# EAGLE design mate_a (EAGLE 9.6.2)
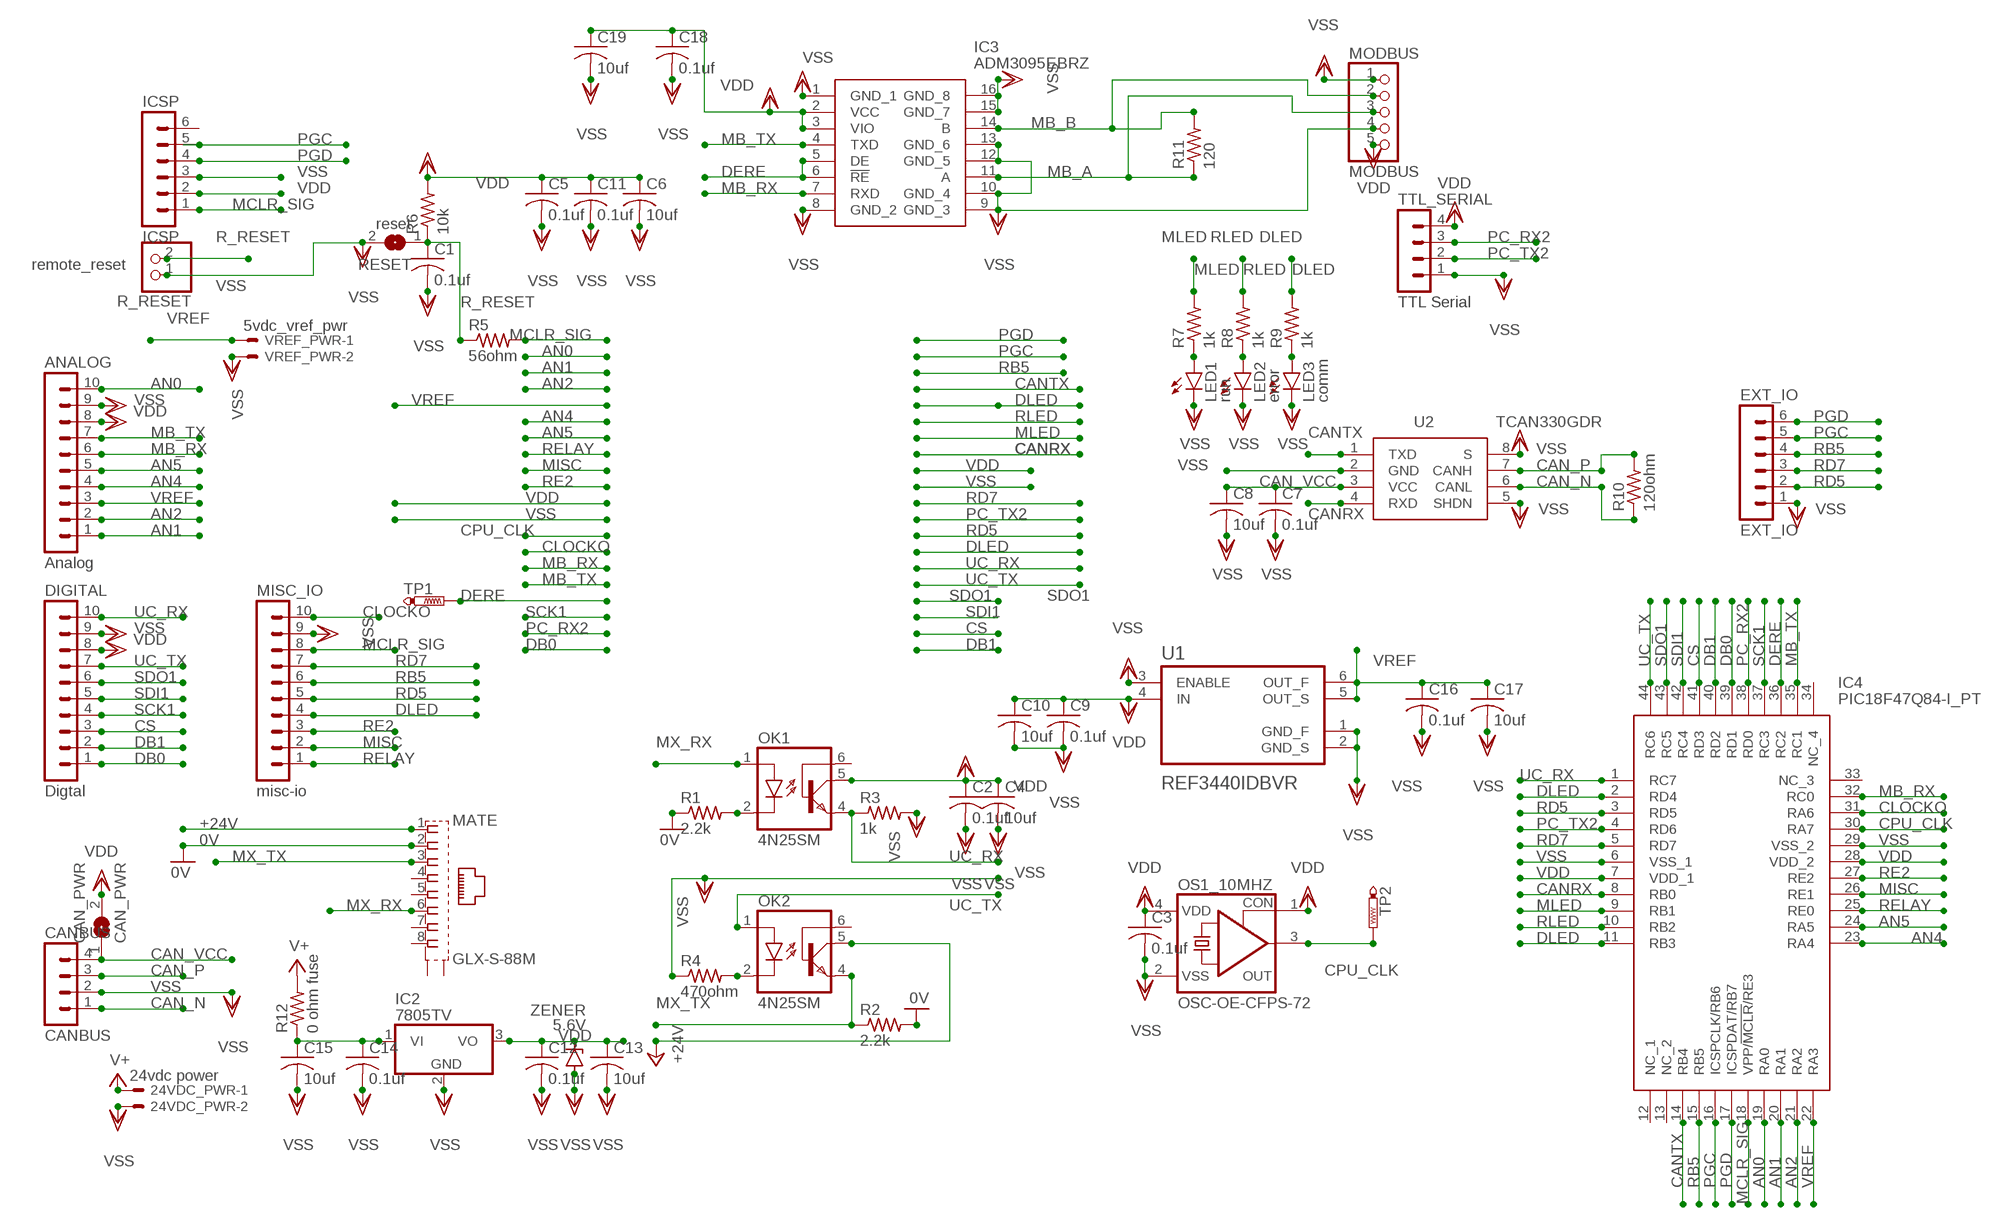
[diagram p0: schematic, sheet 1]

## Parts
24VDC_PWR  24vdc power  22-23-2021  [22-23-2021]
ANALOG  Analog  MA10-1  [MA10-1]
C1  0.1uf  C-USC0805  [C0805]
C2  0.1uf  C-USC0805  [C0805]
C3  0.1uf  C-USC0805  [C0805]
C4  10uf  C-USC0805  [C0805]
C5  0.1uf  C-USC0805  [C0805]
C6  10uf  C-USC0805  [C0805]
C7  0.1uf  C-USC0805  [C0805]
C8  10uf  C-USC0805  [C0805]
C9  0.1uf  C-USC0805  [C0805]
C10  10uf  C-USC0805  [C0805]
C11  0.1uf  C-USC0805  [C0805]
C12  0.1uf  C-USC0805  [C0805]
C13  10uf  C-USC0805  [C0805]
C14  0.1uf  C-USC0805  [C0805]
C15  10uf  C-USC0805  [C0805]
C16  0.1uf  C-USC0805  [C0805]
C17  10uf  C-USC0805  [C0805]
C18  0.1uf  C-USC0805  [C0805]
C19  10uf  C-USC0805  [C0805]
CAN_PWR  CAN_PWR  SJ  [SJ]
CANBUS  CANBUS  MA04-1  [MA04-1]
DIGITAL  Digtal  MA10-1  [MA10-1]
EXT_IO  EXT_IO  MA06-1  [MA06-1]
IC2  7805TV  [TO220V]
IC3  ADM3095EBRZ  [SOIC127P600X175-16N]
IC4  PIC18F47Q84-I_PT  [QFP80P1200X1200X120-44N]
ICSP  ICSP  MA06-1  [MA06-1]
LED1  run  LEDCHIPLED_0805  [CHIPLED_0805]
LED2  error  LEDCHIPLED_0805  [CHIPLED_0805]
LED3  comm  LEDCHIPLED_0805  [CHIPLED_0805]
MATE  GLX-S-88M  [GLX-S-88M]
MISC_IO  misc-io  MA10-1  [MA10-1]
MODBUS  MODBUS  PINHD-1X5  [1X05]
OK1  4N25SM  [DIL6-SMD]
OK2  4N25SM  [DIL6-SMD]
OS1_10MHZ  OSC-OE-CFPS-72  [7.2X5.2-4-PAD]
R1  2.2k  R-US_R0805  [R0805]
R2  2.2k  R-US_R0805  [R0805]
R3  1k  R-US_R0805  [R0805]
R4  470ohm  R-US_R0805  [R0805]
R5  56ohm  R-US_R0805  [R0805]
R6  10k  R-US_R0805  [R0805]
R7  1k  R-US_R0805  [R0805]
R8  1k  R-US_R0805  [R0805]
R9  1k  R-US_R0805  [R0805]
R10  120ohm  R-US_R0805  [R0805]
R11  120  R-US_R0805  [R0805]
R12  0 ohm fuse  R-US_R1206  [R1206]
R_RESET  remote_reset  PINHD-1X2  [1X02]
RESET  reset  SJ  [SJ]
TP1  PTR1PAD1-13  [P1-13]
TP2  PTR1PAD1-13  [P1-13]
TTL_SERIAL  TTL Serial  MA04-1  [MA04-1]
U1  REF3440IDBVR  [SOT95P280X145-6N]
U2  TCAN330GDR  [SOIC127P600X175-8N]
VREF_PWR  5vdc_vref_pwr  22-23-2021  [22-23-2021]
ZENER  5.6V  ZENER-DIODESMB  [SMB]

## Nets
0V [icurrent]: MATE.2 R1.1 R2.2
+24V [icurrent]: MATE.1 OK2.5(COL)
AN0: ANALOG.10 IC4.19(RA0)
AN1: ANALOG.1 IC4.20(RA1)
AN2: ANALOG.2 IC4.21(RA2)
AN4: ANALOG.4 IC4.23(RA4)
AN5: ANALOG.5 IC4.24(RA5)
CAN_N [icurrent]: CANBUS.1 R10.1 U2.6(CANL)
CAN_P [icurrent]: CANBUS.3 R10.2 U2.7(CANH)
CAN_VCC [icurrent]: C7.1 C8.1 CAN_PWR.1 CANBUS.4 U2.3(VCC)
CANRX: IC4.8(RB0) U2.4(RXD)
CANTX: IC4.14(RB4) U2.1(TXD)
CLOCKO: IC4.31(RA6) MISC_IO.10
CPU_CLK: IC4.30(RA7) OS1_10MHZ.3(OUT) TP2.TP
CS: DIGITAL.3 IC4.41(RD3)
DB0: DIGITAL.1 IC4.39(RD1)
DB1: DIGITAL.2 IC4.40(RD2)
DERE: IC3.5(DE) IC3.6(!RE) IC4.36(RC2) TP1.TP
DLED: IC4.2(RD4) IC4.11(RB3) MISC_IO.4 R9.2
MB_A: IC3.11(A) MODBUS.3 R11.1
MB_B: IC3.14(B) MODBUS.2 R11.2
MB_RX: ANALOG.6 IC3.7(RXD) IC4.32(RC0)
MB_TX: ANALOG.7 IC3.4(TXD) IC4.35(RC1)
MCLR_SIG: IC4.18(VPP/!MCLR!/RE3) ICSP.1 MISC_IO.8 R5.2
MISC: IC4.26(RE1) MISC_IO.2
MLED: IC4.9(RB1) R7.2
MX_RX: MATE.6 OK1.1(A)
MX_TX: MATE.3 OK2.4(EMI) R2.1
N$1: OK1.2(C) R1.2
N$2 [icurrent]: C14.1 C15.1 IC2.1(VI) R12.1
N$3: OK2.2(C) R4.2
N$4: LED1.A R7.1
N$5: LED2.A R8.1
N$6: LED3.A R9.1
PC_RX2: IC4.38(RD0) TTL_SERIAL.3
PC_TX2: IC4.4(RD6) TTL_SERIAL.2
PGC: EXT_IO.5 IC4.16(ICSPCLK/RB6) ICSP.5
PGD: EXT_IO.6 IC4.17(ICSPDAT/RB7) ICSP.4
R_RESET: C1.1 R5.1 R6.1 R_RESET.2 RESET.1
RB5: EXT_IO.4 IC4.15(RB5) MISC_IO.6
RD5: EXT_IO.2 IC4.3(RD5) MISC_IO.5
RD7: EXT_IO.3 IC4.5(RD7) MISC_IO.7
RE2: IC4.27(RE2) MISC_IO.3
RELAY: IC4.25(RE0) MISC_IO.1
RLED: IC4.10(RB2) R8.2
SCK1: DIGITAL.4 IC4.37(RC3)
SDI1: DIGITAL.5 IC4.42(RC4)
SDO1: DIGITAL.6 IC4.43(RC5)
UC_RX: DIGITAL.10 IC4.1(RC7) OK1.4(EMI) R3.1
UC_TX: DIGITAL.7 IC4.44(RC6) OK2.1(A)
V+ [icurrent]: 24VDC_PWR.1 R12.2
VDD [icurrent]: ANALOG.8 C2.1 C3.1 C4.1 C5.1 C6.1 C9.1 C10.1 C11.1 C12.1 C13.1 C18.1 C19.1 CAN_PWR.2 DIGITAL.8 IC2.3(VO) IC3.2(VCC) IC3.3(VIO) IC4.7(VDD_1) IC4.28(VDD_2) ICSP.2 MODBUS.5 OK1.5(COL) OS1_10MHZ.1(CON) OS1_10MHZ.4(VDD) R6.2 TTL_SERIAL.4 U1.4(IN) ZENER.C
VREF [icurrent]: ANALOG.3 C16.1 C17.1 IC4.22(RA3) U1.5(OUT_S) U1.6(OUT_F) VREF_PWR.1
VSS [icurrent]: 24VDC_PWR.2 ANALOG.9 C1.2 C2.2 C3.2 C4.2 C5.2 C6.2 C7.2 C8.2 C9.2 C10.2 C11.2 C12.2 C13.2 C14.2 C15.2 C16.2 C17.2 C18.2 C19.2 CANBUS.2 DIGITAL.9 EXT_IO.1 IC2.2(GND) IC3.1(GND_1) IC3.8(GND_2) IC3.9(GND_3) IC3.10(GND_4) IC3.12(GND_5) IC3.13(GND_6) IC3.15(GND_7) IC3.16(GND_8) IC4.6(VSS_1) IC4.29(VSS_2) ICSP.3 LED1.C LED2.C LED3.C MISC_IO.9 MODBUS.1 MODBUS.4 OS1_10MHZ.2(VSS) R3.2 R4.1 R_RESET.1 RESET.2 TTL_SERIAL.1 U1.1(GND_F) U1.2(GND_S) U1.3(ENABLE) U2.2(GND) U2.5(SHDN) U2.8(S) VREF_PWR.2 ZENER.A
Unconnected: IC4.12(NC_1) IC4.13(NC_2) IC4.33(NC_3) IC4.34(NC_4) ICSP.6 MATE.4 MATE.5 MATE.7 MATE.8 MATE.S1 MATE.S2 OK1.6(BAS) OK2.6(BAS)

## Library data of the parts
24VDC_PWR VREF_PWR = con-molex:22-23-2021: .100" (2.54mm) Center Header - 2 Pin; MF: MOLEX; MPN: 22-23-2021; OC_FARNELL: 1462926; OC_NEWARK: 25C3832
ANALOG DIGITAL MISC_IO = con-lstb:MA10-1: PIN HEADER; OC_FARNELL: unknown; OC_NEWARK: unknown
C1-C19 = rcl:C-US: CAPACITOR, American symbol; SPICEPREFIX: C
CAN_PWR RESET = jumper:SJ: SMD solder JUMPER
CANBUS TTL_SERIAL = con-lstb:MA04-1: PIN HEADER; OC_FARNELL: unknown; OC_NEWARK: unknown
EXT_IO ICSP = con-lstb:MA06-1: PIN HEADER; OC_FARNELL: unknown; OC_NEWARK: unknown
IC2 = linear:78*: Positive VOLTAGE REGULATOR Source: http://cache.national.com/ds/LM/LM78L05.pdf http://www.fairchildsemi.com/ds/LM/LM7805.pdf
IC3 = ADM3095EBRZ:ADM3095EBRZ: Level 4 EMC Protected RS-485 Transceiver with Full +/-42 V Fault Protection Source: Datasheet <https://componentsearchengine.com/Datasheets/1/ADM3095EBRZ.pdf>; DESCRIPTION: Level 4 EMC Protected RS-485 Transceiver with Full +/-42 V Fault Protection; HEIGHT: 1.75mm; MANUFACTURER_NAME: Analog Devices; MANUFACTURER_PART_NUMBER: ADM3095EBRZ; MOUSER_PART_NUMBER: 584-ADM3095EBRZ; MOUSER_PRICE-STOCK: https://www.mouser.com/Search/Refine.aspx?Keyword=584-ADM3095EBRZ
IC4 = PIC18F47Q84-I_PT:PIC18F47Q84-I_PT: 8-bit Microcontrollers - MCU CAN-FD, 128KB Flash, 13KB RAM, 12b ADC3, UTMR, DAC, Comp, PWM, CCP, CWG, HLT, WWDT, SCAN/CRC, ZCD, PPS,Comms IDLE/DOZE/PMD, JTAG Source: Datasheet <https://ww1.microchip.com/downloads/en/DeviceDoc/PIC18F27-47-57Q84-Data-Sheet-40002213D.pdf>; DESCRIPTION: 8-bit Microcontrollers - MCU CAN-FD, 128KB Flash, 13KB RAM, 12b ADC3, UTMR, DAC, Comp, PWM, CCP, CWG, HLT, WWDT, SCAN/CRC, ZCD, PPS,Comms IDLE/DOZE/PMD, JTAG; HEIGHT: 1.2mm; MANUFACTURER_NAME: Microchip; MANUFACTURER_PART_NUMBER: PIC18F47Q84-I/PT; MOUSER_PART_NUMBER: 579-PIC18F47Q84-I/PT; MOUSER_PRICE-STOCK: https://www.mouser.co.uk/ProductDetail/Microchip-Technology/PIC18F47Q84-I-PT?qs=d0WKAl%252BL4KYthTnAmf%2FYSg%3D%3D
LED1-LED3 = led:LED: LED OSRAM: - CHIPLED LG R971, LG N971, LY N971, LG Q971, LY Q971, LO R971, LY R971 LH N974, LH R974 LS Q976, LO Q976, LY Q976 LO Q996 - Hyper CHIPLED LW Q18S LB Q993, LB Q99A, LB R99A - SideLED LS A670, LO A670, LY A670, LG A670, LP A670 LB A673, LV A673, LT A673, LW A673 LH A674 LY A675 LS A676, LA A676, LO A676, LY A676, LW A676 LS A679, LY A679, LG A679 - Hyper Micro SIDELED® LS Y876, LA Y876, LO Y876, LY Y876 LT Y87S - SmartLED LW L88C, LW L88S LB L89C, LB L89S, LG L890 LS L89K, LO L89K, LY L89K LS L896, LA L896, LO L896, LY L896 - TOPLED LS T670, LO T670, LY T670, LG T670, LP T670 LSG T670, LSP T670, LSY T670, LOP T670, LYG T670 LG T671, LOG T671, LSG T671 LB T673, LV T673, LT T673, LW T673 LH T674 LS T676, LA T676, LO T676, LY T676, LB T676, LH T676, LSB T676, LW T676 LB T67C, LV T67C, LT T67C, LS T67K, LO T67K, LY T67K, LW E67C LS E67B, LA E67B, LO E67B, LY E67B, LB E67C, LV E67C, LT E67C LW T67C LS T679, LY T679, LG T679 LS T770, LO T770, LY T770, LG T770, LP T770 LB T773, LV T773, LT T773, LW T773 LH T774 LS E675, LA E675, LY E675, LS T675 LS T776, LA T776, LO T776, LY T776, LB T776 LHGB T686 LT T68C, LB T68C - Hyper Mini TOPLED® LB M676 - Mini TOPLED Santana® LG M470 LS M47K, LO M47K, LY M47K Source: http://www.osram.convergy.de LUXEON: - LUMILED® LXK2-PW12-R00, LXK2-PW12-S00, LXK2-PW14-U00, LXK2-PW14-V00 LXK2-PM12-R00, LXK2-PM12-S00, LXK2-PM14-U00 LXK2-PE12-Q00, LXK2-PE12-R00, LXK2-PE12-S00, LXK2-PE14-T00, LXK2-PE14-U00 LXK2-PB12-K00, LXK2-PB12-L00, LXK2-PB12-M00, LXK2-PB14-N00, LXK2-PB14-P00, LXK2-PB14-Q00 LXK2-PR12-L00, LXK2-PR12-M00, LXK2-PR14-Q00, LXK2-PR14-R00 LXK2-PD12-Q00, LXK2-PD12-R00, LXK2-PD12-S00 LXK2-PH12-R00, LXK2-PH12-S00 LXK2-PL12-P00, LXK2-PL12-Q00, LXK2-PL12-R00 Source: www.luxeon.com KINGBRIGHT: KA-3528ASYC Source: www.kingbright.com
MATE = con-kycon:GLX-S-88M: Mod. Jack, Right Angle, 8 posiotion, 8 contatcs RJ45 Source: GLX-S-88M.pdf; OC_FARNELL: unknown; OC_NEWARK: unknown
MODBUS = pinhead:PINHD-1X5: PIN HEADER
OK1 OK2 = optocoupler:4N*?M: General Purpose 6-Pin Phototransistor Optocouplers Source: http://www.fairchildsemi.com/ds/4N/4N35-M.pdf; MF: FAIRCHILD SEMICONDUCTOR; MPN: 4N25SM; OC_FARNELL: 1021152; OC_NEWARK: 34C2020
OS1_10MHZ = IQD-Frequency-Products:OSC-OE: OSCILLATOR WITH OE
R1-R12 = rcl:R-US_: RESISTOR, American symbol; SPICEPREFIX: R
R_RESET = pinhead:PINHD-1X2: PIN HEADER
TP1 TP2 = testpad:PTR1: TEST PIN
U1 = REF3440IDBVR:REF3440IDBVR: Check availability <https://pricing.snapeda.com/parts/REF3440IDBVR/Texas%20Instruments/view-part?ref=eda>; AVAILABILITY: In Stock; DESCRIPTION: 4.1-V, low-drift, low-power, small-footprint series voltage reference; MF: Texas Instruments; MP: REF3440IDBVR; PACKAGE: SOT-23-6 Texas Instruments; PRICE: None; PURCHASE-URL: https://pricing.snapeda.com/search/part/REF3440IDBVR/?ref=eda
U2 = TCAN330GDR:TCAN330GDR: 3.3-V CAN Transceivers with CAN FD (Flexible Data Rate) Source: Datasheet <http://www.ti.com/lit/gpn/TCAN330G>; DESCRIPTION: 3.3-V CAN Transceivers with CAN FD (Flexible Data Rate); HEIGHT: 1.75mm; MANUFACTURER_NAME: Texas Instruments; MANUFACTURER_PART_NUMBER: TCAN330GDR; MOUSER_PART_NUMBER: 595-TCAN330GDR; MOUSER_PRICE-STOCK: https://www.mouser.co.uk/ProductDetail/Texas-Instruments/TCAN330GDR?qs=9DwIlvx97adeWwzxdqwSPw%3D%3D
ZENER = diode:ZENER-DIODE: Z-Diode

## Net classes
1 icurrent: width 0.305 mm

## Board
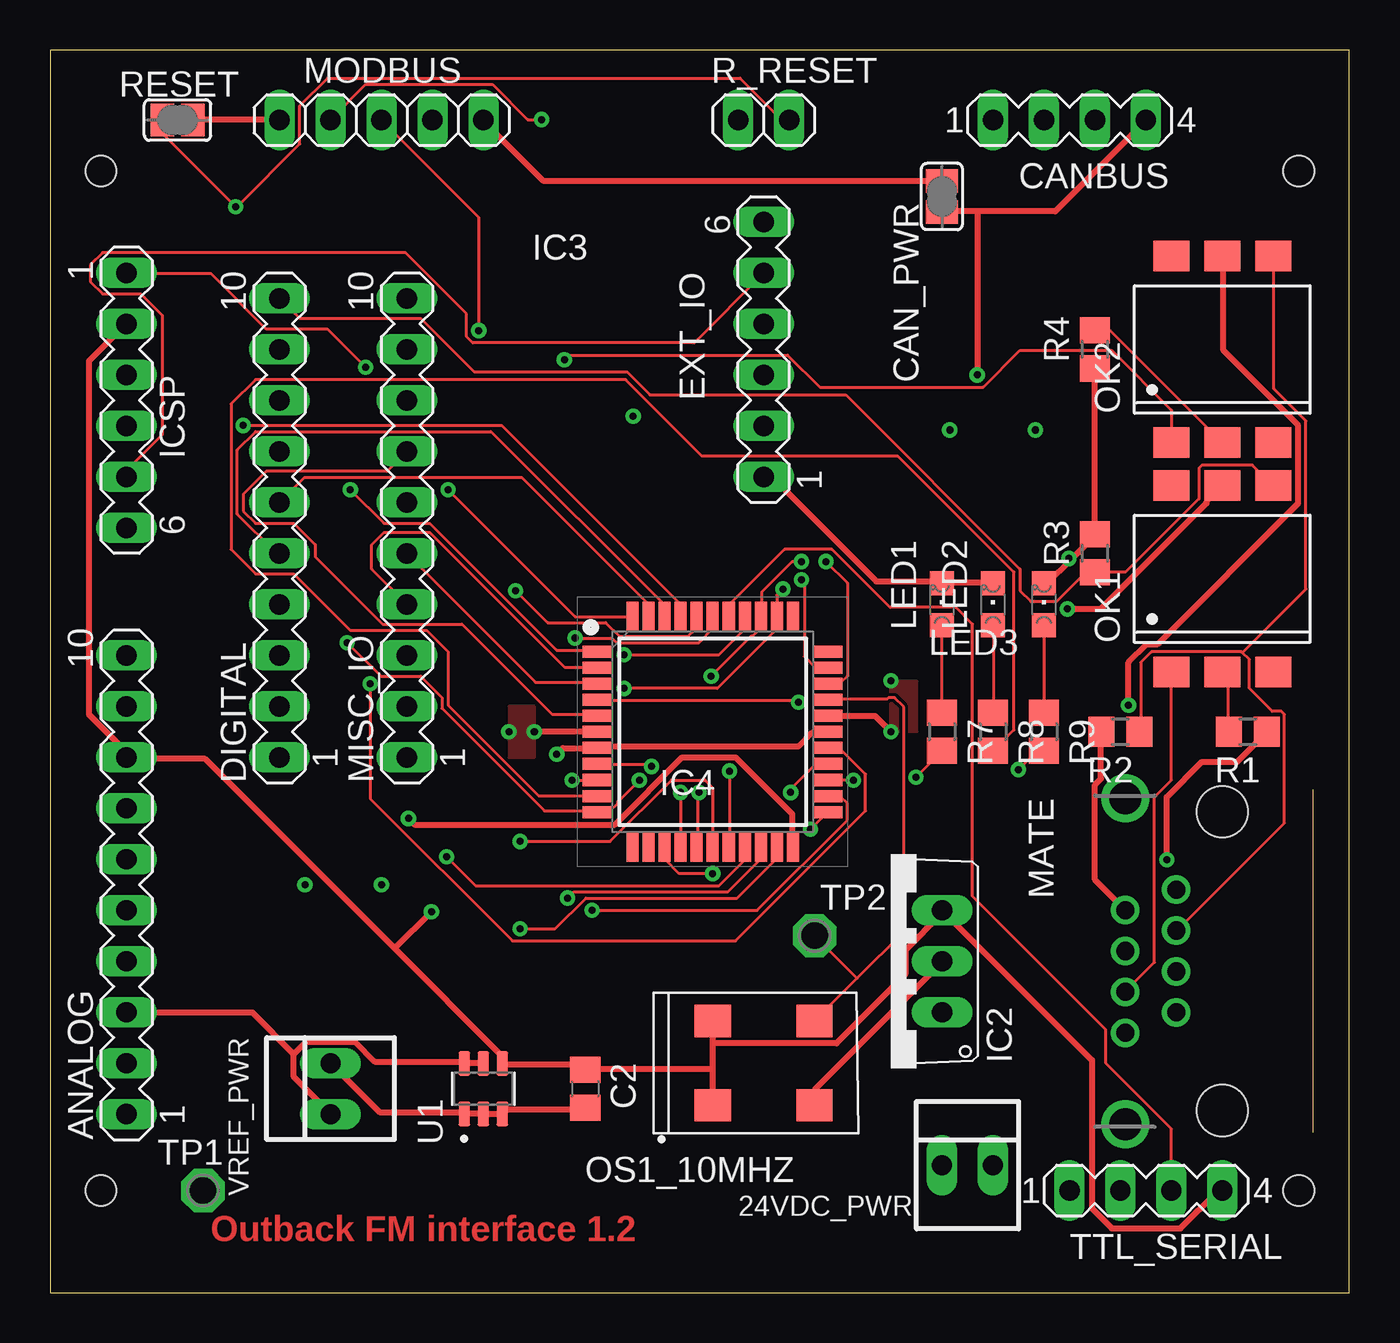
[diagram p1: board, top side]
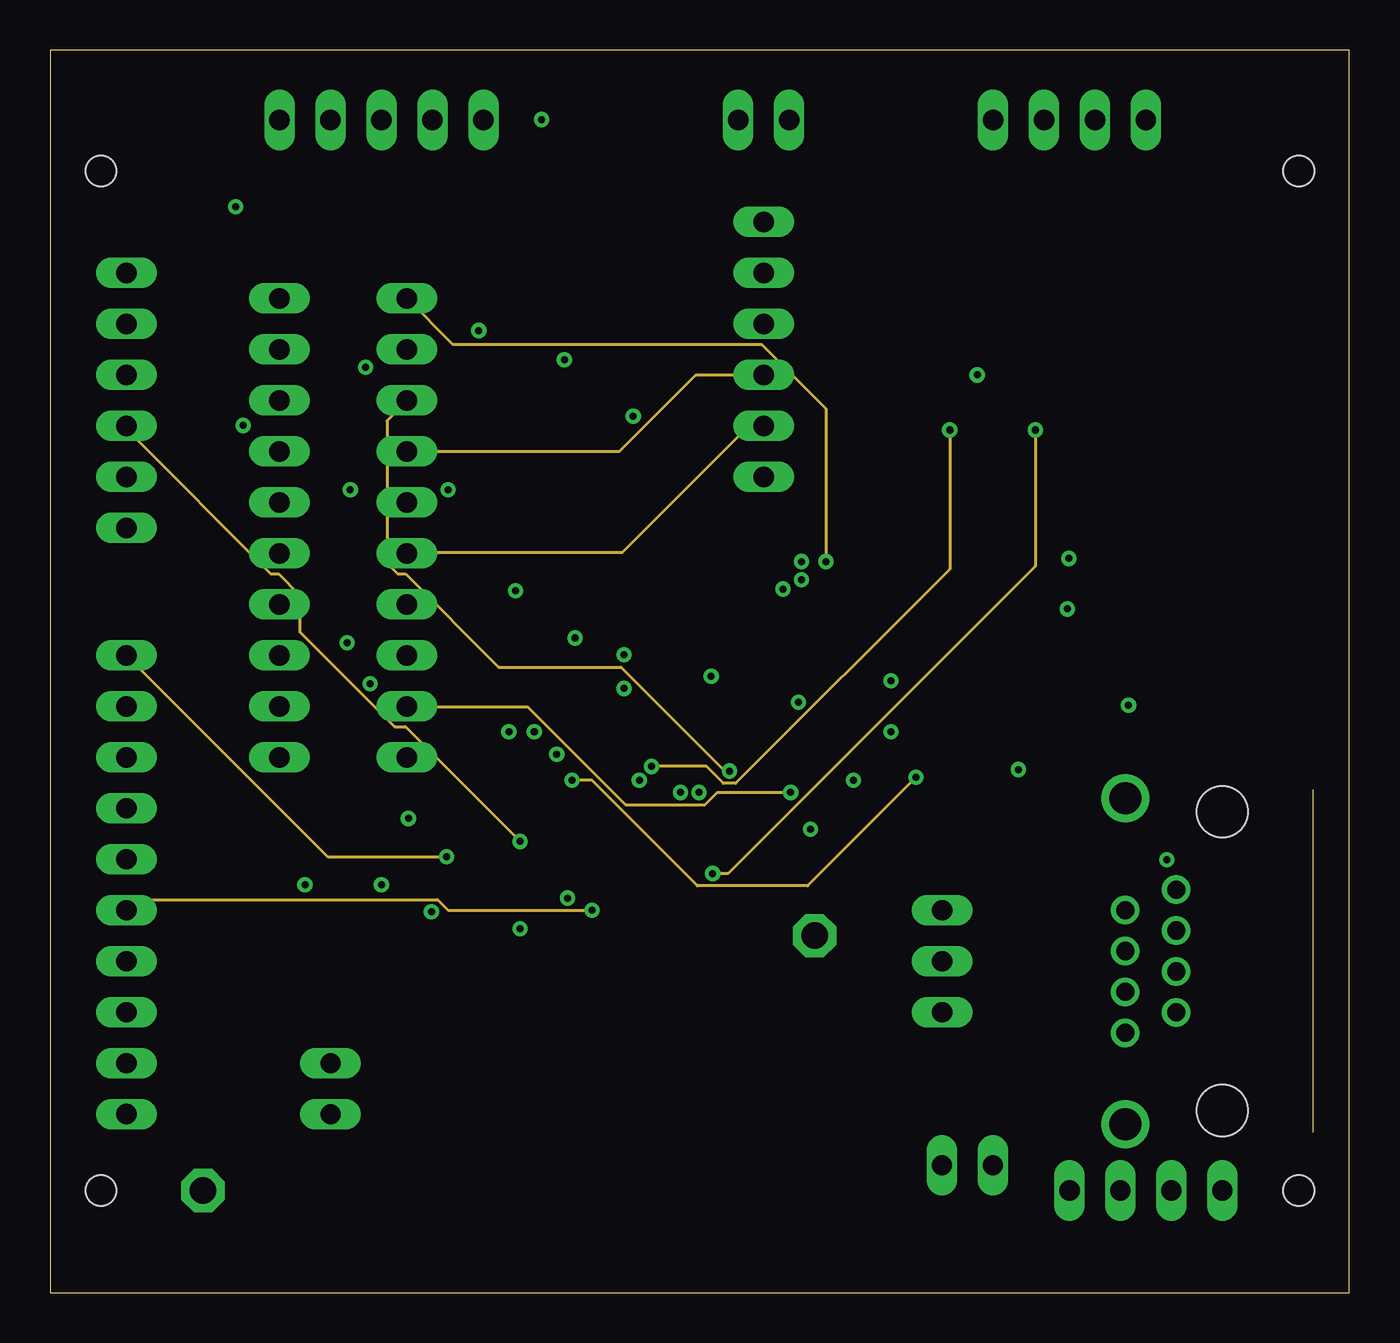
[diagram p2: board, inner layer Route2]
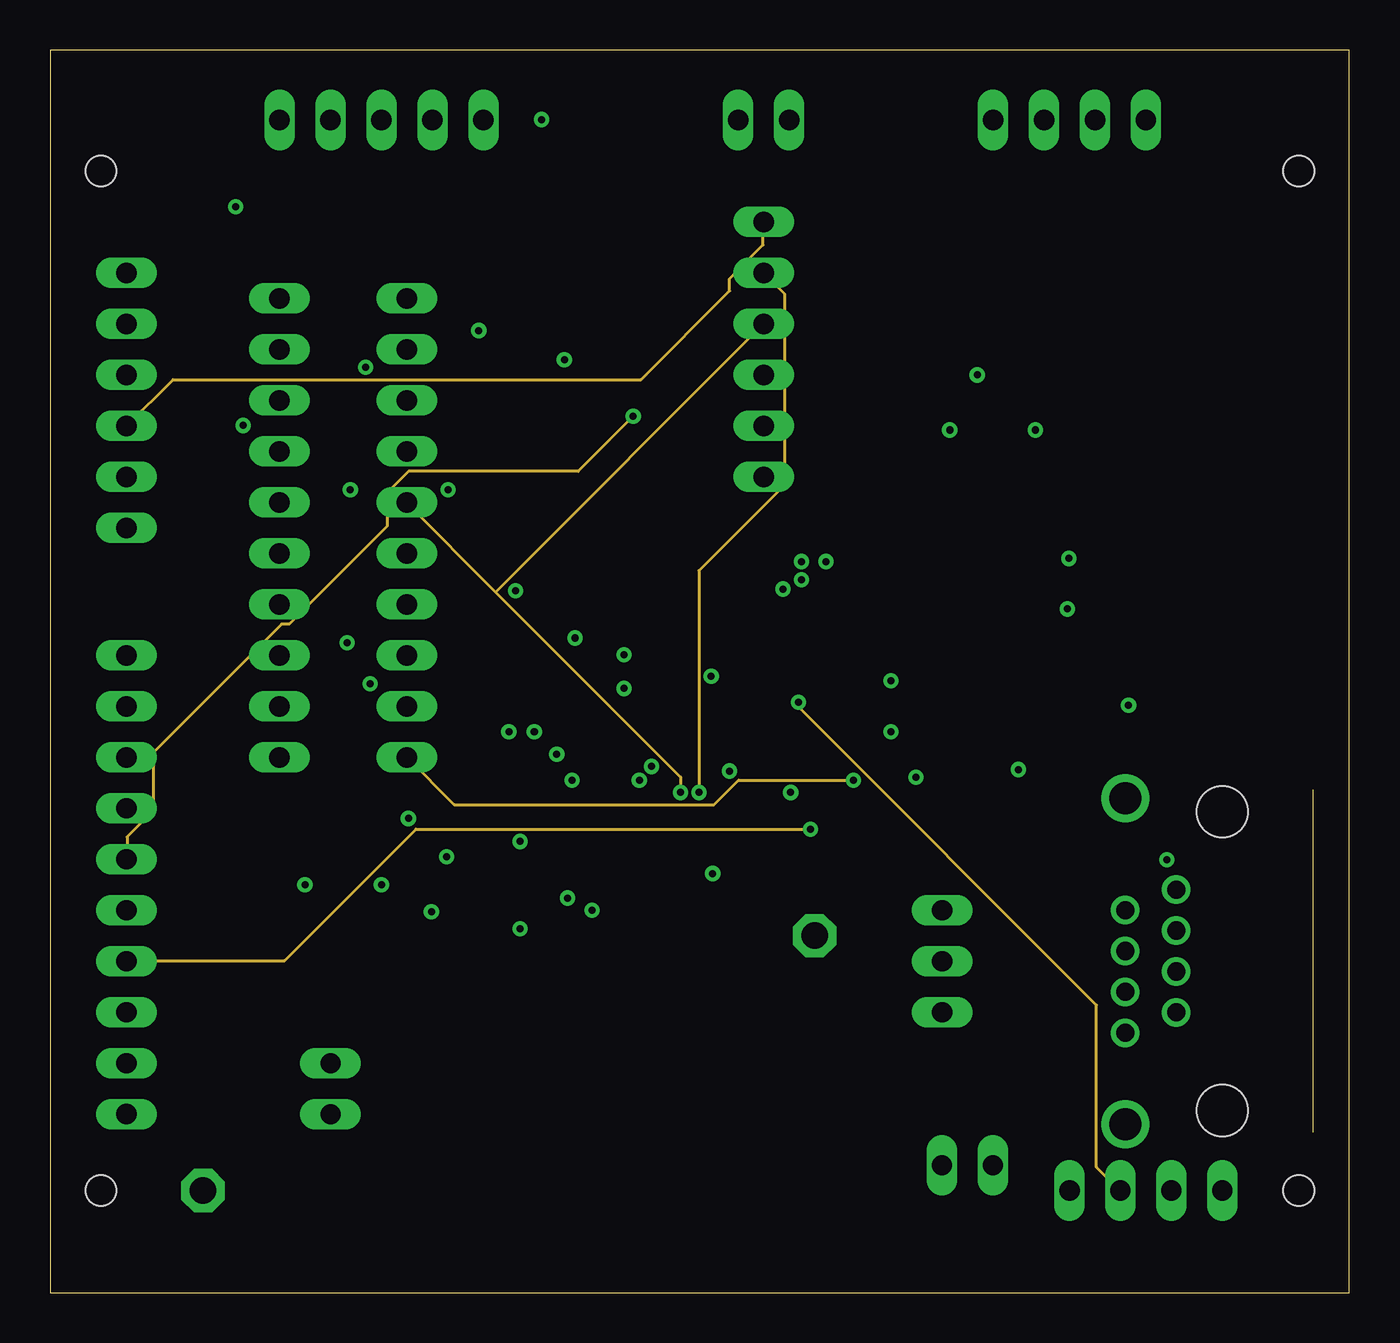
[diagram p3: board, inner layer Route15]
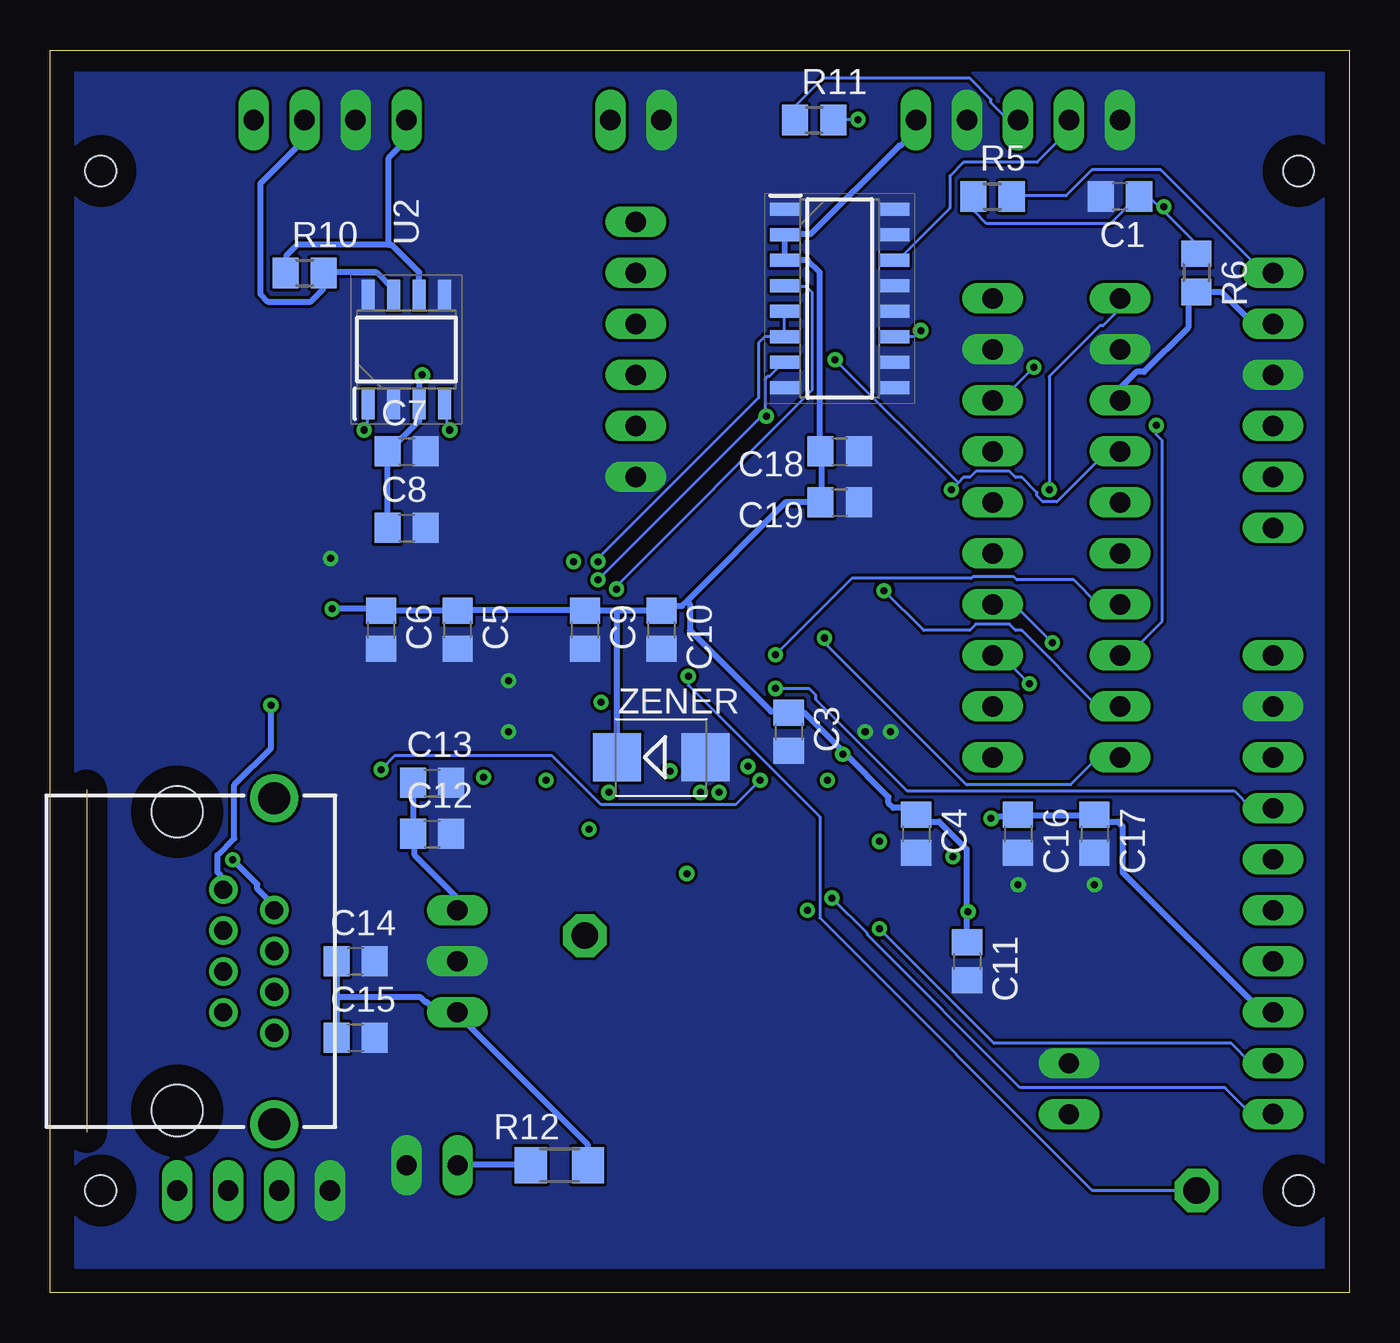
[diagram p4: board, bottom side, seen from below]

Size 64.75 x 61.9 mm. Coordinates in mm from the lower left corner, seen from the top.
Outline: 0,0 64.75,0 64.75,61.9 0,61.9 0,0
Copper layers (1+2*15+16): Top 0.035mm / dielectric 1.5mm / Route2 0.035mm / dielectric 0.15mm / Route15 0.035mm / dielectric 0.2mm / Bottom 0.035mm
Design rules "default *": minimum track width 6mil, minimum drill 0.35mm, track to track 6mil, track to pad 6mil, pad to pad 6mil, via to via 6mil, smd to smd 6mil, copper to edge 40mil, drill to drill 6mil, minimum pad ring 10mil, minimum via ring 8mil, stop-mask expansion 4mil, vias tented up to drill 0mil, thermal gap 10mil
Holes 1.52 mm at 2.54,55.88 62.23,55.88 2.54,5.08 62.23,5.08
vRestrict: area 29.2,26.7 to 36.8,29.2

### Footprints (pad centres in the part's own frame; a part is rotated, then mirrored left to right if it is on the bottom)
22-23-2021 = drill 1 long: 1 -1.27,0; 2 1.27,0
MA10-1 = drill 1.016 long: 1 -11.43,0; 2 -8.89,0; 3 -6.35,0; 4 -3.81,0; 5 -1.27,0; 6 1.27,0; 7 3.81,0; 8 6.35,0; 9 8.89,0; 10 11.43,0
C0805 = smd 1.3 x 1.5: 1 -0.95,0; 2 0.95,0
SJ = smd 1.168 x 1.6: 1 -0.762,0; 2 0.762,0
MA04-1 = drill 1.016 long: 1 -3.81,0; 2 -1.27,0; 3 1.27,0; 4 3.81,0
MA06-1 = drill 1.016 long: 1 -6.35,0; 2 -3.81,0; 3 -1.27,0; 4 1.27,0; 5 3.81,0; 6 6.35,0
TO220V = drill 1.016 long: 1 -2.54,-2.54; 2 0,-2.54; 3 2.54,-2.54
SOIC127P600X175-16N = smd 1.525 x 0.65: 1 -2.712,4.445; 2 -2.712,3.175; 3 -2.712,1.905; 4 -2.712,0.635; 5 -2.712,-0.635; 6 -2.712,-1.905; 7 -2.712,-3.175; 8 -2.712,-4.445; 9 2.712,-4.445; 10 2.712,-3.175; 11 2.712,-1.905; 12 2.712,-0.635; 13 2.712,0.635; 14 2.712,1.905; 15 2.712,3.175; 16 2.712,4.445
QFP80P1200X1200X120-44N = smd 1.475 x 0.6: 1 -5.738,4; 2 -5.738,3.2; 3 -5.738,2.4; 4 -5.738,1.6; 5 -5.738,0.8; 6 -5.738,0; 7 -5.738,-0.8; 8 -5.738,-1.6; 9 -5.738,-2.4; 10 -5.738,-3.2; 11 -5.738,-4; 23 5.738,-4; 24 5.738,-3.2; 25 5.738,-2.4; 26 5.738,-1.6; 27 5.738,-0.8; 28 5.738,0; 29 5.738,0.8; 30 5.738,1.6; 31 5.738,2.4; 32 5.738,3.2; 33 5.738,4 | smd 0.6 x 1.475: 12 -4,-5.738; 13 -3.2,-5.738; 14 -2.4,-5.738; 15 -1.6,-5.738; 16 -0.8,-5.738; 17 0,-5.738; 18 0.8,-5.738; 19 1.6,-5.738; 20 2.4,-5.738; 21 3.2,-5.738; 22 4,-5.738; 34 4,5.738; 35 3.2,5.738; 36 2.4,5.738; 37 1.6,5.738; 38 0.8,5.738; 39 0,5.738; 40 -0.8,5.738; 41 -1.6,5.738; 42 -2.4,5.738; 43 -3.2,5.738; 44 -4,5.738
CHIPLED_0805 = smd 1.2 x 1.2: A 0,-1.05; C 0,1.05
GLX-S-88M = drill 0.9 pad 1.422: 1 -3.57,-2.3; 2 -2.55,-4.84; 3 -1.53,-2.3; 4 -0.51,-4.84; 5 0.51,-2.3; 6 1.53,-4.84; 7 2.55,-2.3; 8 3.57,-4.84 | drill 1.6 pad 2.184: S1 -8.125,-4.84; S2 8.125,-4.84 | hole 2.55: -7.44,0; 7.44,0
1X05 = drill 1.016 long: 1 -5.08,0; 2 -2.54,0; 3 0,0; 4 2.54,0; 5 5.08,0
DIL6-SMD = smd 1.78 x 1.52: 1 -2.54,-4.645; 2 0,-4.645; 3 2.54,-4.645; 4 2.54,4.645; 5 0,4.645; 6 -2.54,4.645
7.2X5.2-4-PAD = smd 1.8 x 1.6: 1 -2.54,-2.1; 2 2.54,-2.1; 3 2.54,2.1; 4 -2.54,2.1
R0805 = smd 1.3 x 1.5: 1 -0.95,0; 2 0.95,0
R1206 = smd 1.6 x 1.803: 1 -1.422,0; 2 1.422,0
1X02 = drill 1.016 long: 1 -1.27,0; 2 1.27,0
P1-13 = drill 1.321 pad 2.159 octagon: TP 0,0
SOT95P280X145-6N = smd 1.21 x 0.58: 1 -1.255,0.95; 2 -1.255,0; 3 -1.255,-0.95; 4 1.255,-0.95; 5 1.255,0; 6 1.255,0.95
SOIC127P600X175-8N = smd 1.528 x 0.65: 1 -2.711,1.905; 2 -2.711,0.635; 3 -2.711,-0.635; 4 -2.711,-1.905; 5 2.711,-1.905; 6 2.711,-0.635; 7 2.711,0.635; 8 2.711,1.905
SMB = smd 2.4 x 2.4: A 2.2,0; C -2.2,0

### Placement (x,y rotation side)
24VDC_PWR  45.72,6.35 0 top
ANALOG  3.81,20.32 90 top
C1  11.43,54.61 180 bottom
C2  26.67,10.16 270 top
C3  27.94,27.94 270 bottom
C4  21.59,22.86 270 bottom
C5  44.45,33.02 270 bottom
C6  48.26,33.02 270 bottom
C7  46.99,41.91 0 bottom
C8  46.99,38.1 0 bottom
C9  38.1,33.02 270 bottom
C10  34.29,33.02 270 bottom
C11  19.05,16.51 270 bottom
C12  45.72,22.86 0 bottom
C13  45.72,25.4 0 bottom
C14  49.53,16.51 0 bottom
C15  49.53,12.7 0 bottom
C16  16.51,22.86 270 bottom
C17  12.7,22.86 270 bottom
C18  25.4,41.91 0 bottom
C19  25.4,39.37 0 bottom
CAN_PWR  44.45,54.61 90 top
CANBUS  50.8,58.42 0 top
DIGITAL  11.43,38.1 90 top
EXT_IO  35.56,46.99 90 top
IC2  41.91,16.51 90 top
IC3  25.4,49.53 0 bottom
IC4  33.02,27.94 0 top
ICSP  3.81,44.45 270 top
LED1  44.45,34.29 0 top
LED2  46.99,34.29 0 top
LED3  49.53,34.29 0 top
MATE  58.42,16.51 270 top
MISC_IO  17.78,38.1 90 top
MODBUS  16.51,58.42 0 top
OK1  58.42,35.56 0 top
OK2  58.42,46.99 0 top
OS1_10MHZ  35.56,11.43 0 top
R1  59.69,27.94 180 top
R2  53.34,27.94 180 top
R3  52.07,36.83 90 top
R4  52.07,46.99 90 top
R5  17.78,54.61 0 bottom
R6  7.62,50.8 270 bottom
R7  44.45,27.94 270 top
R8  46.99,27.94 270 top
R9  49.53,27.94 270 top
R10  52.07,50.8 0 bottom
R11  26.67,58.42 0 bottom
R12  39.37,6.35 180 bottom
R_RESET  35.56,58.42 0 top
RESET  6.35,58.42 0 top
TP1  7.62,5.08 0 top
TP2  38.1,17.78 0 top
TTL_SERIAL  54.61,5.08 0 top
U1  21.59,10.16 90 top
U2  46.99,46.99 90 bottom
VREF_PWR  13.97,10.16 90 top
ZENER  34.29,26.67 0 bottom

### Tracks (layer width: path | path; a pad name or v marks a point on that pad's centre or on a via)
0V  (via drill 0.35)
  Top 0.305: R2.2 52.38,27.89 52.38,25.6 52.07,25.3 52.07,20.57 53.52,19.13 MATE.2 | v55.65,21.56 55.65,24.69 57.4,26.44 59.16,26.44 60.6,27.89 R1.1
  Bottom 0.305: v55.65,21.56 54.43,20.34 54.43,20.12 53.59,19.28 53.59,19.13 MATE.2
+24V  (via drill 0.35)
  Top 0.305: v53.75,29.26 53.75,31.39 54.66,32.31 55.19,32.31 62.21,39.32 62.21,43.2 58.47,46.94 58.47,51.59 OK2.5
  Bottom 0.305: v53.75,29.26 53.75,27.13 55.58,25.3 55.58,22.63 56.41,21.79 56.41,20.95 56.26,20.8 56.26,20.73 56.19,20.65 56.19,20.12 MATE.1
AN0  (via drill 0.35)
  Top 0.152: v19.76,21.72 21.21,20.27 33.33,20.27 34.54,21.49 34.54,22.17 IC4.19
  Route2 0.152: v19.76,21.72 13.82,21.72 3.84,31.7 ANALOG.10
AN1  (via drill 0.35)
  Top 0.152: v25.78,19.66 26.09,19.96 33.78,19.96 35.38,21.56 35.38,22.17 IC4.20
  Bottom 0.152: v25.78,19.66 24.03,17.91 24.03,17.83 16.41,10.21 6.2,10.21 4.9,8.92 3.84,8.92 ANALOG.1
AN2  (via drill 0.35)
  Top 0.152: v23.42,18.14 25.17,18.14 26.7,19.66 34.24,19.66 36.14,21.56 36.14,22.17 IC4.21
  Bottom 0.152: v23.42,18.14 17.7,12.42 5.89,12.42 4.9,11.43 ANALOG.2
AN4  (via drill 0.35)
  Top 0.152: v37.9,23.09 38.73,23.93 IC4.23
  Route15 0.152: v37.9,23.09 18.24,23.09 11.68,16.53 3.84,16.53 ANALOG.4
AN5  (via drill 0.35)
  Top 0.152: v27,19.05 35.23,19.05 39.73,23.55 39.73,24.38 39.42,24.69 38.81,24.69 IC4.24
  Route2 0.152: v27,19.05 19.84,19.05 19.3,19.58 4.37,19.58 3.84,19.05 ANALOG.5
CAN_N
  Bottom 0.305: 47.88,52.2 47.73,52.2 46.36,50.82 U2.6 | 47.88,52.2 52.45,52.2 52.98,51.66 52.98,50.82 R10.1 | 47.88,52.2 47.88,56.54 47.04,57.38 47.04,58.37 CANBUS.1
CAN_P
  Bottom 0.305: U2.7 47.65,49.76 47.65,49.99 48.49,50.82 51.08,50.82 R10.2 51.16,50.67 51.16,49.99 51.77,49.38 53.9,49.38 54.28,49.76 54.28,55.24 52.07,57.45 CANBUS.3
CAN_VCC  (via drill 0.35)
  Top 0.305: 46.2,53.87 50.09,53.87 54.59,58.37 CANBUS.4 | 46.2,53.87 44.45,53.87 CAN_PWR.1 | 46.2,53.87 v46.2,45.72
  Bottom 0.305: C8.1 47.95,38.1 47.95,41.91 C7.1 47.8,41.99 46.36,43.43 U2.3 46.36,45.57 v46.2,45.72
CANRX  (via drill 0.35)
  Top 0.152: v29.97,26.21 29.9,26.29 27.31,26.29 IC4.8
  Route2 0.152: v29.97,26.21 32.72,26.21 33.55,25.38 34.16,25.38 44.83,36.04 v44.83,42.98
  Bottom 0.152: v44.83,42.98 44.98,43.13 44.98,44.2 45.06,44.27 U2.4
CANTX  (via drill 0.35)
  Top 0.152: v33.02,20.88 31.34,20.88 30.66,21.56 30.66,22.17 IC4.14
  Route2 0.152: v33.02,20.88 33.78,20.88 49.1,36.2 v49.1,42.98
  Bottom 0.152: v49.1,42.98 48.95,43.13 48.95,44.27 U2.1
CLOCKO  (via drill 0.35)
  Top 0.152: v38.66,36.42 39.73,35.36 39.73,30.71 39.42,30.4 38.81,30.4 IC4.31
  Route2 0.152: v38.66,36.42 38.66,44.04 35.46,47.24 20.07,47.24 MISC_IO.10
CPU_CLK
  Top 0.152: 40.22,15.66 38.12,13.56 OS1_10MHZ.3 | 40.22,15.66 42.55,17.98 42.55,29.18 42.09,29.64 41.78,29.64 41.71,29.57 38.81,29.57 IC4.30 | 40.22,15.66 TP2.TP
CS  (via drill 0.35)
  Top 0.152: v9.63,43.2 22.5,43.2 31.42,34.29 IC4.41
  Bottom 0.152: v9.63,43.2 9.63,42.75 9.32,42.44 9.32,33.45 11,31.77 11.38,31.77 DIGITAL.3
DB0  (via drill 0.35)
  Top 0.152: IC4.39 33.02,33.07 32.33,32.38 28.22,32.38 27.99,32.61 v26.16,32.61
  Bottom 0.152: v26.16,32.61 26.16,32.38 19.08,25.3 13.89,25.3 12.52,26.67 DIGITAL.1
DB1  (via drill 0.35)
  Top 0.152: v23.19,34.98 24.79,33.38 27.69,33.38 28.37,32.69 31.8,32.69 32.18,33.07 32.18,33.6 IC4.40
  Bottom 0.152: v23.19,34.98 21.21,32.99 18.92,32.99 18.62,33.3 16.94,33.3 16.64,32.99 16.33,32.99 12.6,29.26 11.45,29.26 DIGITAL.2
DERE  (via drill 0.35)
  Top 0.152: v37.44,36.42 36.98,36.42 35.46,34.9 35.46,33.68 IC4.36 35.38,33.6 35.38,33.07 35,32.69 34.92,32.69 v32.94,30.71
  Bottom 0.152: v37.44,36.42 37.44,36.58 29.44,44.58 29.44,47.32 29.13,47.62 28.14,47.62 | 28.14,47.62 28.14,48.84 IC3.5 | 28.14,47.62 IC3.6 | v32.94,30.71 32.94,30.25 26.39,23.7 26.39,18.67 12.83,5.1 7.65,5.1 TP1.TP
DLED  (via drill 0.35)
  Top 0.152: v14.81,32.38 16.48,30.71 18.47,30.71 19.53,29.64 19.53,29.11 24.64,24 27.23,24 IC4.11 27.31,24 27.92,24 28.3,24.38 28.3,24.46 v29.36,25.53 | MISC_IO.4 16.03,36.04 16.03,37.26 16.64,37.87 18.92,37.87 25.63,31.17 27.23,31.17 IC4.2 | v48.26,26.06 49.17,26.98 49.48,26.98 R9.2
  Bottom 0.152: v14.81,32.38 16.71,34.29 MISC_IO.4 | v48.26,26.06 47.57,26.75 39.73,26.75 37.29,24.31 30.58,24.31 v29.36,25.53
MB_A  (via drill 0.35)
  Top 0.152: v21.36,47.93 21.36,53.57 MODBUS.3
  Bottom 0.152: R11.1 27.61,58.45 27.61,59.13 26.24,60.5 18.92,60.5 17.86,59.44 17.86,59.28 17.02,58.45 16.56,58.45 MODBUS.3 | IC3.11 21.67,47.62 v21.36,47.93
MB_B  (via drill 0.35)
  Top 0.152: v24.49,58.45 23.8,58.45 22.05,60.2 15.72,60.2 13.97,58.45 MODBUS.2
  Bottom 0.152: v24.49,58.45 25.7,58.45 R11.2 | IC3.14 22.5,51.43 19.91,54.03 19.91,55.63 19.23,56.31 15.57,56.31 13.97,57.91 MODBUS.2
MB_RX  (via drill 0.35)
  Top 0.152: v37.44,35.51 37.59,35.36 37.59,31.7 38.12,31.17 38.73,31.17 IC4.32
  Route15 0.152: v29.06,43.66 26.31,40.92 17.86,40.92 16.79,39.85 16.79,38.18 11.91,33.3 11.53,33.3 5.13,26.9 5.13,24 3.84,22.71 3.84,21.64 ANALOG.6
  Bottom 0.152: 29.17,43.78 29.13,43.81 29.13,45.49 28.98,45.64 28.91,45.64 28.14,46.41 IC3.7 | 29.17,43.78 v37.44,35.51 | 29.17,43.78 v29.06,43.66
MB_TX  (via drill 0.35)
  Top 0.152: v36.53,35.05 36.22,34.75 IC4.35 36.14,33.6 36.14,32.99 33.25,30.1 v28.6,30.1
  Bottom 0.152: v36.53,35.05 36.53,35.2 26.77,44.96 26.77,49.84 27.08,50.14 28.07,50.14 IC3.4 | v28.6,30.1 26.92,30.1 26.62,29.79 26.62,29.57 22.05,24.99 5.74,24.99 4.9,24.16 3.84,24.16 ANALOG.7
MCLR_SIG  (via drill 0.35)
  Top 0.152: v33.86,25.98 33.86,22.25 IC4.18 | v15.72,46.1 13.82,48.01 10.77,48.01 8.03,50.75 3.84,50.75 ICSP.1
  Route2 0.152: v33.86,25.98 33.63,25.98 28.45,31.17 22.35,31.17 17.7,35.81 17.32,35.81 16.79,36.35 16.79,43.43 17.78,44.42 MISC_IO.8
  Bottom 0.152: R5.2 16.79,54.63 14.12,54.63 12.83,55.93 9.4,55.93 4.29,50.82 3.84,50.82 ICSP.1 | v15.72,46.1 17.32,44.5 17.78,44.5 MISC_IO.8
MISC  (via drill 0.35)
  Top 0.152: v36.91,24.92 36.91,25.07 38.12,26.29 38.73,26.29 IC4.26
  Route2 0.152: v36.91,24.92 33.25,24.92 32.64,24.31 28.68,24.31 23.8,29.18 17.78,29.18 MISC_IO.2
MLED  (via drill 0.35)
  Top 0.152: v26.01,25.53 27.23,25.53 IC4.9 | v43.16,25.68 44.45,26.98 R7.2
  Route2 0.152: v26.01,25.53 27,25.53 32.26,20.27 37.74,20.27 v43.16,25.68
MX_RX
  Top 0.152: OK1.1 55.88,25.53 55.04,24.69 55.04,16.46 53.59,15.01 MATE.6
MX_TX
  Top 0.152: 59.42,31.89 59.77,31.55 59.77,30.1 60.91,28.96 61.37,28.96 61.52,28.8 61.52,23.39 56.19,18.06 MATE.3 | 59.42,31.89 59.38,31.93 54.89,31.93 54.36,31.39 54.36,27.96 R2.1 | 59.42,31.89 62.59,35.05 62.59,43.43 60.99,45.03 60.99,51.59 OK2.4
N$1
  Top 0.152: R1.2 58.7,27.96 58.7,30.63 58.47,30.86 OK1.2
N$2
  Bottom 0.305: 50.47,14.71 50.47,16.46 C14.1 | 50.47,14.71 50.47,12.72 C15.1 | 50.47,14.71 46.28,14.71 46.05,14.48 45.97,14.48 45.52,14.02 44.45,14.02 IC2.1 44.45,13.87 37.97,7.39 37.97,6.4 R12.1
N$3
  Top 0.152: R4.2 52.83,47.93 58.4,42.37 OK2.2
N$4
  Top 0.152: R7.1 LED1.A
N$5
  Top 0.152: LED2.A 47.04,33.22 47.04,28.96 R8.1
N$6
  Top 0.152: LED3.A 49.56,33.22 49.56,28.96 R9.1
PC_RX2
  Top 0.152: TTL_SERIAL.3 55.88,8.15 52.6,11.43 52.6,13.11 45.97,19.74 45.97,33.3 45.14,34.14 41.86,34.14 38.96,37.03 36.6,37.03 33.86,34.29 33.86,33.68 IC4.38
PC_TX2  (via drill 0.35)
  Top 0.152: v37.29,29.41 37.21,29.49 27.31,29.49 IC4.4
  Route15 0.152: v37.29,29.41 37.29,29.18 52.15,14.33 52.15,6.25 53.29,5.1 TTL_SERIAL.2
PGC  (via drill 0.35)
  Top 0.152: v32.33,24.92 32.26,24.84 32.26,22.25 IC4.16 | ICSP.5 3.84,40.69 3.84,41 5.59,42.75 5.59,48.69 4.52,49.76 2.62,49.76 2.01,50.37 2.01,51.21 2.62,51.82 17.7,51.82 20.75,48.77 20.75,47.62 21.06,47.32 32.11,47.32 35.53,50.75 EXT_IO.5
  Route15 0.152: v32.33,24.92 32.33,35.97 36.6,40.23 36.6,49.76 EXT_IO.5
PGD  (via drill 0.35)
  Top 0.152: IC4.17 33.02,25.15 32.64,25.53 30.96,25.53 27.92,22.48 v23.42,22.48
  Route2 0.152: v23.42,22.48 17.7,28.19 17.17,28.19 12.45,32.92 12.45,34.75 11.38,35.81 11,35.81 3.84,42.98 3.84,43.13 ICSP.4
  Route15 0.152: ICSP.4 6.12,45.49 29.44,45.49 33.86,49.91 33.86,50.52 35.53,52.2 35.53,53.34 EXT_IO.6
R_RESET  (via drill 0.35)
  Top 0.152: RESET.1 5.59,57.76 v9.25,54.1 9.25,54.18 9.4,54.18 12.45,57.23 12.45,59.13 13.82,60.5 34.39,60.5 36.45,58.45 36.83,58.45 R_RESET.2
  Bottom 0.152: 9.36,53.99 9.93,54.56 10.47,54.56 C1.1 10.54,54.63 11.91,53.26 18.09,53.26 18.69,53.87 18.69,54.56 R5.1 | 9.36,53.99 7.65,52.27 7.65,51.82 R6.1 | 9.36,53.99 v9.25,54.1
RB5  (via drill 0.35)
  Top 0.152: v31.42,24.92 31.42,22.25 IC4.15
  Route15 0.152: v31.42,24.92 31.42,25.68 22.2,34.9 | 22.2,34.9 17.78,39.32 MISC_IO.6 | 22.2,34.9 EXT_IO.4
RD5
  Top 0.152: IC4.3 27.23,30.4 24.18,30.4 17.78,36.8 MISC_IO.5
  Route2 0.152: EXT_IO.2 35.53,43.13 34.77,43.13 28.52,36.88 17.78,36.88 MISC_IO.5
RD7
  Top 0.152: MISC_IO.7 16.79,40.92 10.77,40.92 9.63,39.78 9.63,38.94 10.24,38.33 12.14,38.33 13.21,37.26 13.21,36.65 16.56,33.3 20.52,33.3 25.02,28.8 27.23,28.8 IC4.5
  Route2 0.152: EXT_IO.3 32.18,45.72 28.37,41.91 MISC_IO.7
RE2  (via drill 0.35)
  Top 0.152: v15.95,30.33 15.95,24.61 23.04,17.53 34.16,17.53 40.64,24 40.64,25.83 39.34,27.13 38.81,27.13 IC4.27
  Bottom 0.152: v15.95,30.33 17.32,31.7 17.78,31.7 MISC_IO.3
RELAY  (via drill 0.35)
  Top 0.152: v40.03,25.53 38.81,25.53 IC4.25
  Route15 0.152: v40.03,25.53 34.31,25.53 33.1,24.31 20.14,24.31 MISC_IO.1
RLED
  Top 0.152: IC4.10 27.23,24.77 24.33,24.77 19.84,29.26 19.84,31.93 18.77,32.99 14.96,32.99 12.14,35.81 10.24,35.81 9.02,37.03 9.02,44.27 10.24,45.49 28.68,45.49 32.49,41.68 42.24,41.68 48.03,35.89 48.03,28.04 47.04,27.05 R8.2
SCK1  (via drill 0.35)
  Top 0.152: v28.6,31.77 33.33,31.77 34.54,32.99 34.54,33.6 IC4.37
  Bottom 0.152: v28.6,31.77 24.79,35.59 18.85,35.59 18.77,35.66 16.71,35.66 16.56,35.51 13.74,35.51 12.52,34.29 DIGITAL.4
SDI1
  Top 0.152: IC4.42 30.58,33.68 30.58,34.29 21.97,42.9 10.24,42.9 9.32,41.99 9.32,38.79 11.23,36.88 11.38,36.88 DIGITAL.5
SDO1
  Top 0.152: DIGITAL.6 12.67,40.61 23.5,40.61 29.82,34.29 IC4.43
UC_RX  (via drill 0.35)
  Top 0.152: OK1.4 60.91,40.23 59.92,41.22 57.4,41.22 57.25,41.07 57.25,39.55 53.59,35.89 R3.1 52.07,35.81 51.54,35.81 50.17,34.44 48.87,34.44 48.34,34.98 48.34,36.04 39.65,44.73 29.9,44.73 28.75,45.87 21.13,45.87 18.47,48.54 12.45,48.54 11.45,49.53 DIGITAL.10 | v14.96,40 16.64,38.33 18.92,38.33 25.25,32 27.23,32 IC4.1
  Bottom 0.152: v14.96,40 14.96,45.64 12.45,48.16 12.29,48.16 11.45,49 11.45,49.53 DIGITAL.10
UC_TX  (via drill 0.35)
  Top 0.152: v19.84,40 26.16,33.68 28.98,33.68 IC4.44 | OK2.1 55.88,43.97 52.91,46.94 48.34,46.94 46.51,45.11 38.35,45.11 36.75,46.71 25.86,46.71 v25.63,46.48
  Bottom 0.152: 19.49,40.35 19.23,40.61 18.92,40.61 18.62,40.92 16.94,40.92 16.64,40.61 16.33,40.61 15.57,39.85 15.57,39.7 15.27,39.39 14.58,39.39 12.06,41.91 DIGITAL.7 | 19.49,40.35 v19.84,40 | 19.49,40.35 v25.63,46.48
V+
  Bottom 0.305: R12.2 40.79,6.4 44.45,6.4 24VDC_PWR.1
VDD  (via drill 0.35)
  Top 0.305: CAN_PWR.2 44.45,55.4 24.56,55.4 21.59,58.37 MODBUS.5 | IC4.28 38.73,27.89 37.97,27.89 37.29,27.2 27.31,27.2 IC4.7 27.15,27.13 25.55,27.13 v25.25,26.82 | v50.7,34.06 52.38,34.06 57.63,39.32 57.63,39.39 58.4,40.16 OK1.5 | ICSP.2 3.76,48.23 1.93,46.41 1.93,28.8 3.76,26.98 3.76,26.67 ANALOG.8 3.91,26.59 7.72,26.59 17.17,17.14 | OS1_10MHZ.4 33.02,12.42 | 33.02,12.42 33.02,11.12 | 33.02,11.12 OS1_10MHZ.1 | 33.02,11.12 26.77,11.12 C2.1 26.62,11.12 26.39,11.35 22.58,11.35 U1.4 22.43,11.51 22.43,11.89 17.17,17.14 | TTL_SERIAL.4 58.4,5.03 58.17,5.03 56.34,3.2 52.91,3.2 51.92,4.19 51.92,11.58 IC2.3 44.45,18.9 42.62,17.07 42.62,15.85 39.19,12.42 33.02,12.42 | 17.17,17.14 v19,18.97
  Bottom 0.305: MODBUS.5 21.59,57.91 22.35,57.15 22.43,57.15 26.85,52.73 27.99,52.73 IC3.2 28.14,52.65 28.14,51.43 IC3.3 27,51.43 26.39,50.82 26.39,41.99 C18.1 26.31,41.91 26.31,39.39 C19.1 26.47,39.39 28.07,39.39 33.02,34.44 | 19.08,18.97 19.08,22.1 20.45,23.47 21.28,23.47 21.59,23.77 C4.1 21.67,23.93 21.9,24.16 22.73,24.16 22.96,24.38 22.96,24.69 25.17,26.9 | 19.08,18.97 19.08,17.53 C11.1 | 25.17,26.9 27.15,28.88 27.92,28.88 C3.1 28.07,28.96 28.83,28.96 32.87,32.99 32.87,34.29 33.02,34.44 | v25.25,26.82 25.17,26.9 | v50.7,34.06 48.34,34.06 C6.1 48.26,33.98 44.45,33.98 C5.1 44.37,33.98 38.2,33.98 C9.1 38.05,33.98 36.53,33.98 | 36.53,33.98 34.31,33.98 C10.1 34.16,34.06 34.01,34.21 33.25,34.21 33.02,34.44 | 36.53,33.98 36.53,26.67 ZENER.C | ICSP.2 3.84,48.31 4.83,48.31 6.35,49.84 7.57,49.84 R6.2 7.72,49.76 8.03,49.45 8.03,48.08 10.24,45.87 10.62,45.87 11.38,45.11 11.38,44.5 DIGITAL.8 | C13.1 46.66,25.38 C12.1 46.58,22.78 46.58,21.79 44.45,19.66 IC2.3 | v19,18.97 19.08,18.97
VREF  (via drill 0.35)
  Top 0.305: U1.5 21.59,11.43 20.68,11.43 U1.6 20.52,11.51 16.18,11.51 15.19,12.5 12.75,12.5 12.14,11.89 | 12.14,11.89 12.14,10.74 13.97,8.92 VREF_PWR.1 | 12.14,11.89 10.08,13.94 3.84,13.94 ANALOG.3 | v17.86,23.62 18.16,23.32 28.14,23.32 31.5,26.67 34.16,26.67 36.98,23.85 36.98,22.25 IC4.22
  Bottom 0.305: v17.86,23.62 17.78,23.7 16.64,23.7 16.56,23.77 C16.1 16.41,23.77 12.75,23.77 C17.1 12.6,23.7 12.37,23.47 11.53,23.47 11.3,23.24 11.3,20.95 4.37,14.02 3.84,14.02 ANALOG.3
VSS  (via drill 0.35)
  Top 0.305: IC4.6 v24.13,27.94 | 50.85,36.5 52.07,37.72 R3.2 R4.1 | 50.85,36.5 49.71,35.36 49.56,35.36 LED3.C | C2.2 26.62,9.14 22.81,9.14 22.66,8.99 U1.3 22.5,8.92 21.67,8.92 U1.2 21.59,8.92 20.68,8.92 U1.1 20.52,8.99 16.41,8.99 VREF_PWR.2 | LED2.C 46.97,35.36 44.45,35.36 LED1.C 44.37,35.43 41.17,35.43 35.99,40.61 35.61,40.61 EXT_IO.1 | RESET.2 7.11,58.45 11.38,58.45 MODBUS.1 | OS1_10MHZ.2 38.12,9.37 38.12,10.13 44.45,16.46 IC2.2 | v50.78,36.58 50.85,36.5 | IC4.29 41.11,28.74 v41.91,27.94
  other vias: 12.7,20.32 16.51,20.32 22.86,27.94 41.91,30.48
  pour Bottom (no thermals): 1.27,60.96 63.5,60.96 63.5,1.27 1.27,1.27
  pour Top (no thermals): 41.91,30.48 43.18,30.48 43.18,27.94 41.91,27.94
  pour Top (no thermals): 22.86,26.67 24.13,26.67 24.13,29.21 22.86,29.21

### Text on the board
Top: Outback FM interface 1.2